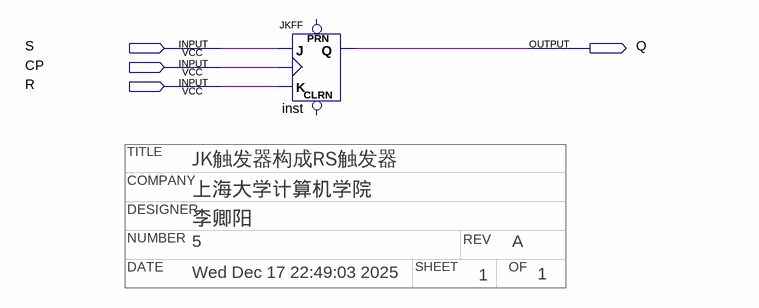
[diagram p0: schematic sheet]
// Quartus schematic SIKAO4.bdf as structural Verilog: 1 symbols, 4 pins
// Title block: TITLE: JK触发器构成RS触发器; COMPANY: 上海大学计算机学院; DESIGNER: 李卿阳; NUMBER: 5; REV: A; DATE: Wed Dec 17 22:49:03 2025; SHEET: 1; OF: 1
module SIKAO4 (
  input  S,
  input  CP,
  input  R,
  output Q
);

  JKFF inst (.K(R), .J(S), .CLK(CP), .Q(Q));  // open: PRN, CLRN
endmodule
